# Altium schematic sheet 7_seg_display.SchDoc
size A4
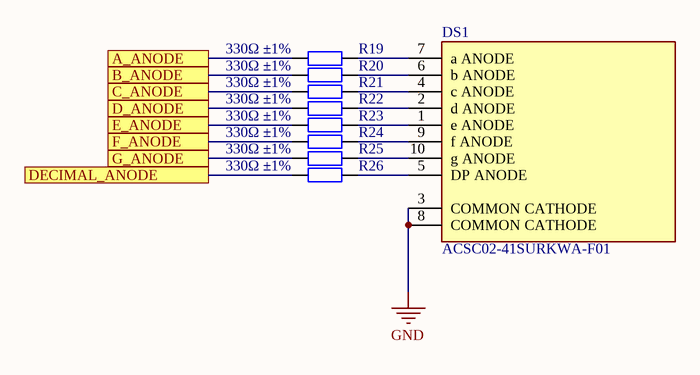
[diagram p0: 7_seg_display.SchDoc]

## Parts
DS1  ACSC02-41SURKWA-F01  [FP-ACSC02-41SURKWA-F01-MFG]
R19  330Ω ±1%  [0603_R]
R20  330Ω ±1%  [0603_R]
R21  330Ω ±1%  [0603_R]
R22  330Ω ±1%  [0603_R]
R23  330Ω ±1%  [0603_R]
R24  330Ω ±1%  [0603_R]
R25  330Ω ±1%  [0603_R]
R26  330Ω ±1%  [0603_R]

## Ports
A_ANODE, B_ANODE, C_ANODE, D_ANODE, DECIMAL_ANODE, E_ANODE, F_ANODE, G_ANODE

## Nets
GND: DS1.3(COMMON_CATHODE) DS1.8(COMMON_CATHODE)
A_ANODE: R19.2 ; port A_ANODE
B_ANODE: R20.2 ; port B_ANODE
C_ANODE: R21.2 ; port C_ANODE
D_ANODE: R22.2 ; port D_ANODE
DECIMAL_ANODE: R26.2 ; port DECIMAL_ANODE
E_ANODE: R23.2 ; port E_ANODE
F_ANODE: R24.2 ; port F_ANODE
G_ANODE: R25.2 ; port G_ANODE
NetDS1_1: DS1.1(e_ANODE) R23.1
NetDS1_2: DS1.2(d_ANODE) R22.1
NetDS1_4: DS1.4(c_ANODE) R21.1
NetDS1_5: DS1.5(DP_ANODE) R26.1
NetDS1_6: DS1.6(b_ANODE) R20.1
NetDS1_7: DS1.7(a_ANODE) R19.1
NetDS1_9: DS1.9(f_ANODE) R24.1
NetDS1_10: DS1.10(g_ANODE) R25.1

## Library data of the parts
DS1 = CMP-44525-000002-1: DISPLAY 7-SEG 0.2" SGL RED 10SMD; Element Configuration: Common Cathode; Operating Supply Voltage: 1.95V; Wavelength: 630nm; Power Consumption: 75mW; Number of Characters: 1; Forward Current: 30mA; Test Current: 20mA; Luminous Intensity: 30mcd; Min Operating Temperature: -40°C; Package Quantity: 650; Height: 0.315inch; Packaging: Tape and Reel; Width: 0.272inch; Max Power Dissipation: 75mW; Color: Red; Illumination Color: Red; Lead Free: Lead Free; Case/Package: SMD/SMT; Max Operating Temperature: 85°C; Forward Voltage: 1.95V
R19-R26 = 0603 330R (3300) 1%: Chip resistor; Manufacturer: Uniroyal Elec; PartNumber: 0603WAF3300T5E; Power: 1/10W; ComponentLink1Description: Supplier link; ComponentLink1URL: http://www.szlcsc.com/product/details_23865.html; Package: 0603; Supplier: LC; SuppliersPartNumber: C23138; Resistance: 330Ω; Tolerance: 1%